# EAGLE schematic Hiking Log Rev B (EAGLE 9.4.2)
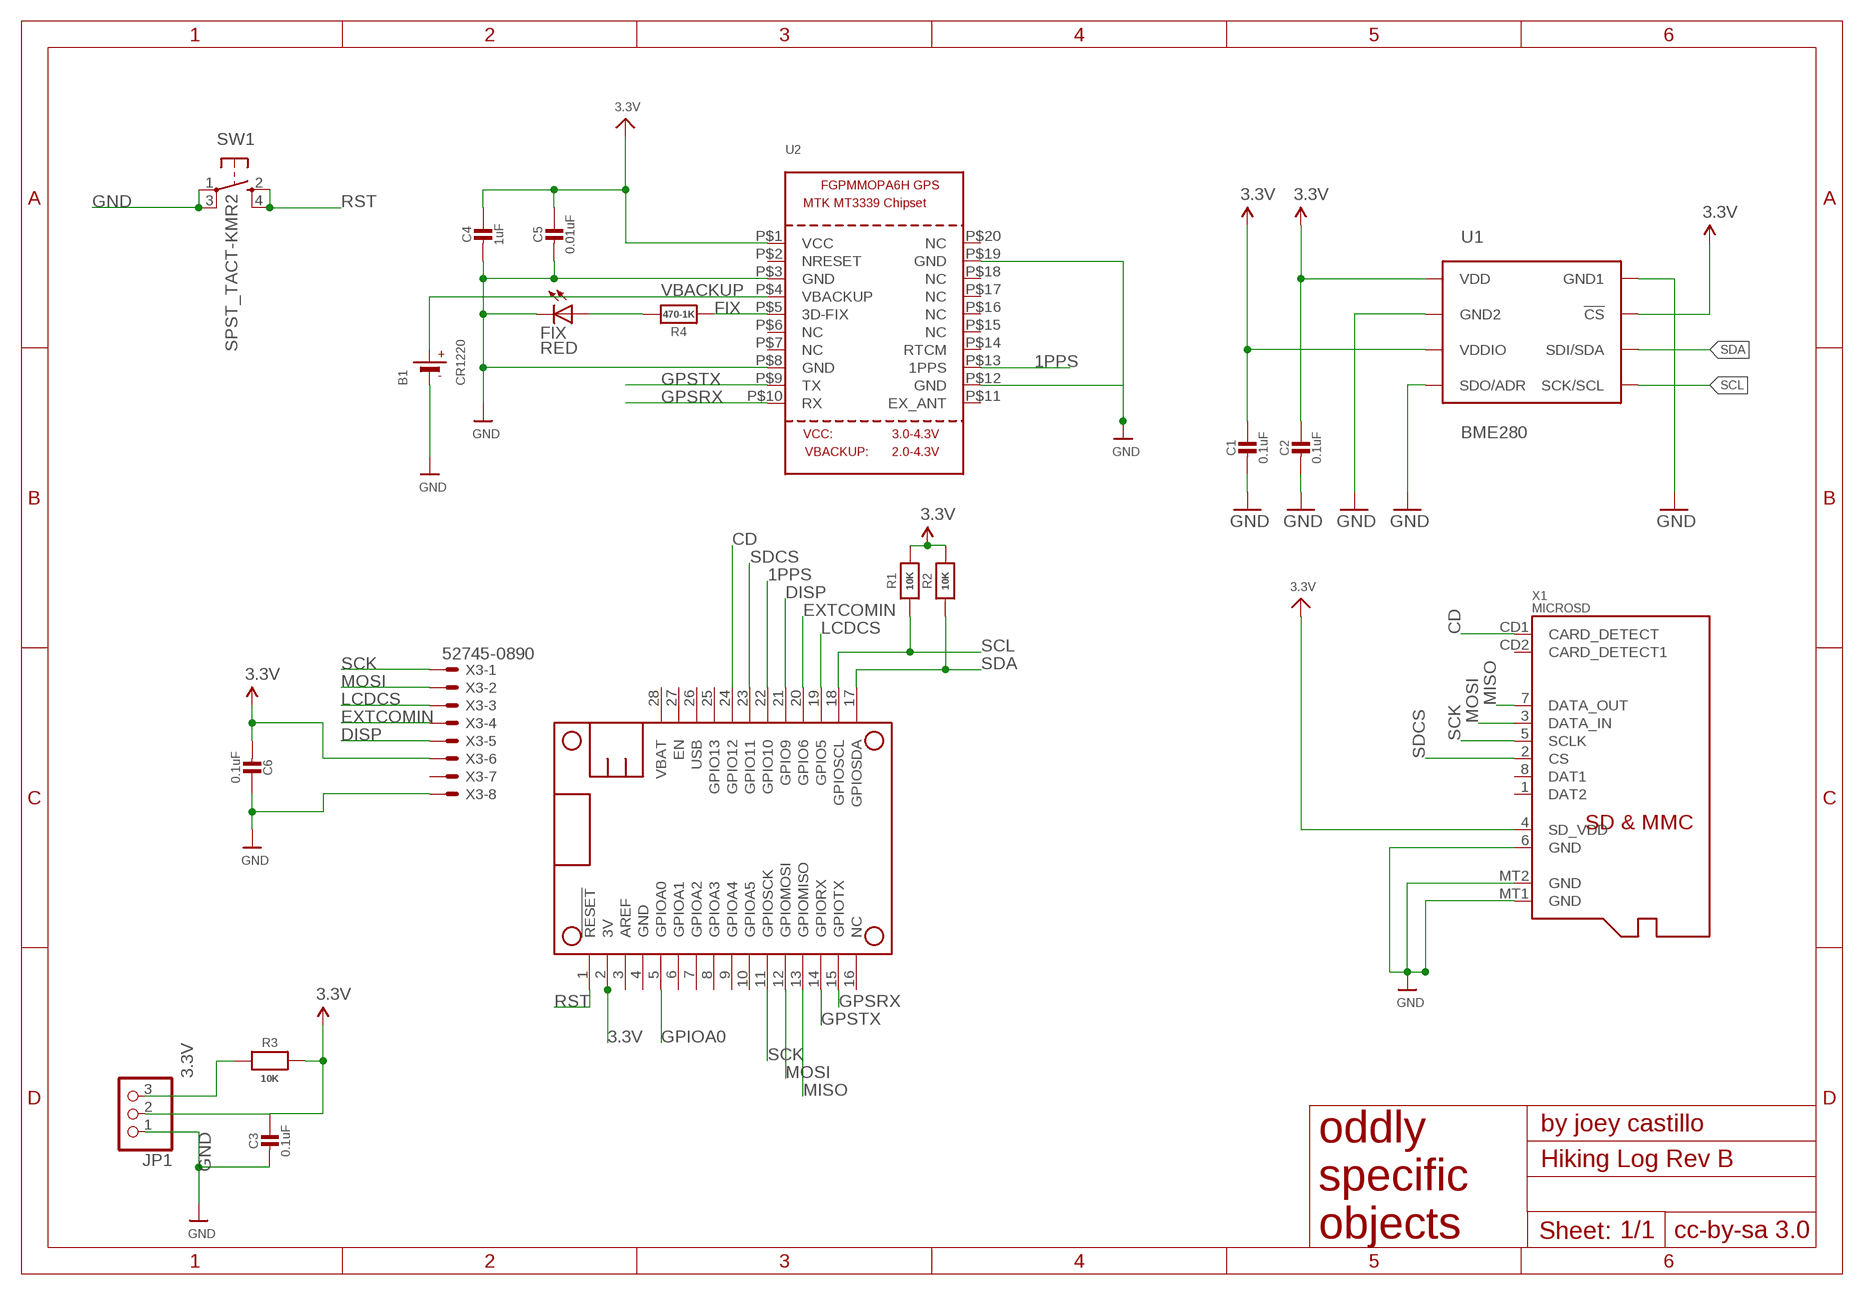
[diagram p0: schematic, sheet 1]

## Parts
B1  CR1220  BATTERYCR1220_2  [CR1220-2]
C1  0.1uF  CAP_CERAMIC_0805MP  [_0805MP]
C2  0.1uF  CAP_CERAMIC_0805MP  [_0805MP]
C3  0.1uF  CAP_CERAMIC_0805MP  [_0805MP]
C4  1uF  CAP_CERAMIC_0805MP  [_0805MP]
C5  0.01uF  CAP_CERAMIC_0805MP  [_0805MP]
C6  0.1uF  CAP_CERAMIC_0805MP  [_0805MP]
FIX  RED  LEDCHIP-LED0805  [CHIP-LED0805]
JP1  PINHD-1X3CB  [1X03-CLEANBIG]
MS1  FEATHERWING  [FEATHERWING]
R1  10K  RESISTOR_0805MP  [_0805MP]
R2  10K  RESISTOR_0805MP  [_0805MP]
R3  10K  RESISTOR_0805MP  [_0805MP]
R4  470-1K  RESISTOR_0805MP  [_0805MP]
SW1  SPST_TACT-KMR2  [KMR2]
U1  BME280  [BME280_LGA]
U2  GPS_FGPMMOPA6H  [FGPMMOPA6H]
X1  MICROSD  [MICROSD]
X3  52745-0890  [52745-0890]

## Nets
1PPS: MS1.22(GPIO10) U2.P$13(1PPS)
3.3V [power]: C1.1 C2.1 C3.1 C4.1 C5.1 C6.2 JP1.2 MS1.2(3V) R1.2 R2.2 R3.2 U1.P$2(!CS) U1.P$6(VDDIO) U1.P$8(VDD) U2.P$1(VCC) X1.4(SD_VDD) X3.6
CD: MS1.24(GPIO12) X1.CD1(CARD_DETECT)
DISP: MS1.21(GPIO9) X3.5
EXTCOMIN: MS1.20(GPIO6) X3.4
FIX: R4.1 U2.P$5(3D-FIX)
GND [power]: B1.- C1.2 C2.2 C3.2 C4.2 C5.2 C6.1 FIX.C JP1.1 SW1.1(P) SW1.3(P1) U1.P$1(GND1) U1.P$5(SDO/ADR) U1.P$7(GND2) U2.P$3(GND) U2.P$8(GND) U2.P$12(GND) U2.P$19(GND) X1.6(GND) X1.MT1(GND) X1.MT2(GND) X3.8
GPIOA0: JP1.3 MS1.5(GPIOA0) R3.1
GPSRX: MS1.15(GPIOTX) U2.P$10(RX)
GPSTX: MS1.14(GPIORX) U2.P$9(TX)
LCDCS: MS1.19(GPIO5) X3.3
MISO: MS1.13(GPIOMISO) X1.7(DATA_OUT)
MOSI: MS1.12(GPIOMOSI) X1.3(DATA_IN) X3.2
N$2: FIX.A R4.2
RST: MS1.1(!RESET) SW1.2(S) SW1.4(S1)
SCK: MS1.11(GPIOSCK) X1.5(SCLK) X3.1
SCL: MS1.18(GPIOSCL) R1.1 U1.P$4(SCK/SCL)
SDA: MS1.17(GPIOSDA) R2.1 U1.P$3(SDI/SDA)
SDCS: MS1.23(GPIO11) X1.2(CS)
VBACKUP: B1.+ U2.P$4(VBACKUP)
Unconnected: MS1.3(AREF) MS1.6(GPIOA1) MS1.7(GPIOA2) MS1.8(GPIOA3) MS1.9(GPIOA4) MS1.10(GPIOA5) MS1.16(NC) MS1.25(GPIO13) MS1.26(USB) MS1.27(EN) MS1.28(VBAT) U2.P$2(NRESET) U2.P$6(NC) U2.P$7(NC) U2.P$11(EX_ANT) U2.P$14(RTCM) U2.P$15(NC) U2.P$16(NC) U2.P$17(NC) U2.P$18(NC) U2.P$20(NC) X1.1(DAT2) X1.8(DAT1) X1.CD2(CARD_DETECT1) X3.7

## Power pins joined to a net without a drawn wire
GND: MS1.4(GND)

## Library data of the parts
B1 = microbuilder:BATTERY: CR1220 SMT - Digikey: 3001K-ND CD2032 BAT-HLD-001 - Digikey: BAT-HLD-001-ND
C1-C6 = microbuilder:CAP_CERAMIC: Ceramic Capacitors For new designs, use the packages preceded by an '_' character since they are more reliable: The following footprints should be used on most boards: _0402 - Standard footprint for regular board layouts _0603 - Standard footprint for regular board layouts _0805 - Standard footprint for regular board layouts _1206 - Standard footprint for regular board layouts For extremely tight-pitch boards where space is at a premium, the following 'micro-pitch' footprints can be used (smaller pads, no silkscreen outline, etc.): _0402MP - Micro-pitch footprint for very dense/compact boards _0603MP - Micro-pitch footprint for very dense/compact boards _0805MP - Micro-pitch footprint for very dense/compact boards _1206MP - Micro-pitch footprint for very dense/compact boards
FIX = adafruit:LED: LED OSRAM: - CHIPLED LG R971, LG N971, LY N971, LG Q971, LY Q971, LO R971, LY R971 LH N974, LH R974 LS Q976, LO Q976, LY Q976 LO Q996 - Hyper CHIPLED LW Q18S LB Q993, LB Q99A, LB R99A - SideLED LS A670, LO A670, LY A670, LG A670, LP A670 LB A673, LV A673, LT A673, LW A673 LH A674 LY A675 LS A676, LA A676, LO A676, LY A676, LW A676 LS A679, LY A679, LG A679 - Hyper Micro SIDELED® LS Y876, LA Y876, LO Y876, LY Y876 LT Y87S - SmartLED LW L88C, LW L88S LB L89C, LB L89S, LG L890 LS L89K, LO L89K, LY L89K LS L896, LA L896, LO L896, LY L896 - TOPLED LS T670, LO T670, LY T670, LG T670, LP T670 LSG T670, LSP T670, LSY T670, LOP T670, LYG T670 LG T671, LOG T671, LSG T671 LB T673, LV T673, LT T673, LW T673 LH T674 LS T676, LA T676, LO T676, LY T676, LB T676, LH T676, LSB T676, LW T676 LB T67C, LV T67C, LT T67C, LS T67K, LO T67K, LY T67K, LW E67C LS E67B, LA E67B, LO E67B, LY E67B, LB E67C, LV E67C, LT E67C LW T67C LS T679, LY T679, LG T679 LS T770, LO T770, LY T770, LG T770, LP T770 LB T773, LV T773, LT T773, LW T773 LH T774 LS E675, LA E675, LY E675, LS T675 LS T776, LA T776, LO T776, LY T776, LB T776 LHGB T686 LT T68C, LB T68C - Hyper Mini TOPLED® LB M676 - Mini TOPLED Santana® LG M470 LS M47K, LO M47K, LY M47K Source: http://www.osram.convergy.de/
JP1 = adafruit:PINHD-1X3: PIN HEADER
MS1 = microbuilder:FEATHERWING
R1-R4 = microbuilder:RESISTOR: Resistors For new designs, use the packages preceded by an '_' character since they are more reliable: The following footprints should be used on most boards: _0402 - Standard footprint for regular board layouts _0603 - Standard footprint for regular board layouts _0805 - Standard footprint for regular board layouts _1206 - Standard footprint for regular board layouts For extremely tight-pitch boards where space is at a premium, the following 'micro-pitch' footprints can be used (smaller pads, no silkscreen outline, etc.): _0402MP - Micro-pitch footprint for very dense/compact boards _0603MP - Micro-pitch footprint for very dense/compact boards _0805MP - Micro-pitch footprint for very dense/compact boards _1206MP - Micro-pitch footprint for very dense/compact boards
SW1 = adafruit:SPST_TACT: SMT 6mm switch, EVQQ2 series http://www.ladyada.net/library/eagle
U1 = BME280ComponentLibrary:BME280; PROD_ID: IC-13090
U2 = adafruit:GPS_FGPMMOPA6H: GPS Module - MTK MT3339 Chipset, -165dBm sensitivity, 22 channels, 10Hz, auto-select external antenna options
X1 = microbuilder:MICROSD: MicroSD/Transflash Card Holder with SPI pinout 3M: 2908-05WB-MG 4UConnector: 19656 Footprint courtesy: Adafruit Industries
X3 = con-molex:52745-0890: FFC/FPC-to-Board 0.50mm (.020") SMT Top Contact Right Angle, ZIF, Style Receptacle 52745 / 52435 Source: http://www.molex.com/product/ffc/52745.html; MF: MOLEX; MPN: 52745-0890; OC_FARNELL: unknown; OC_NEWARK: 92M6377

## Net classes
0 default: width 0.06 mm
1 power: width 0.12 mm